# EAGLE schematic TRV_SX1231_V0.1 (EAGLE 6.3)
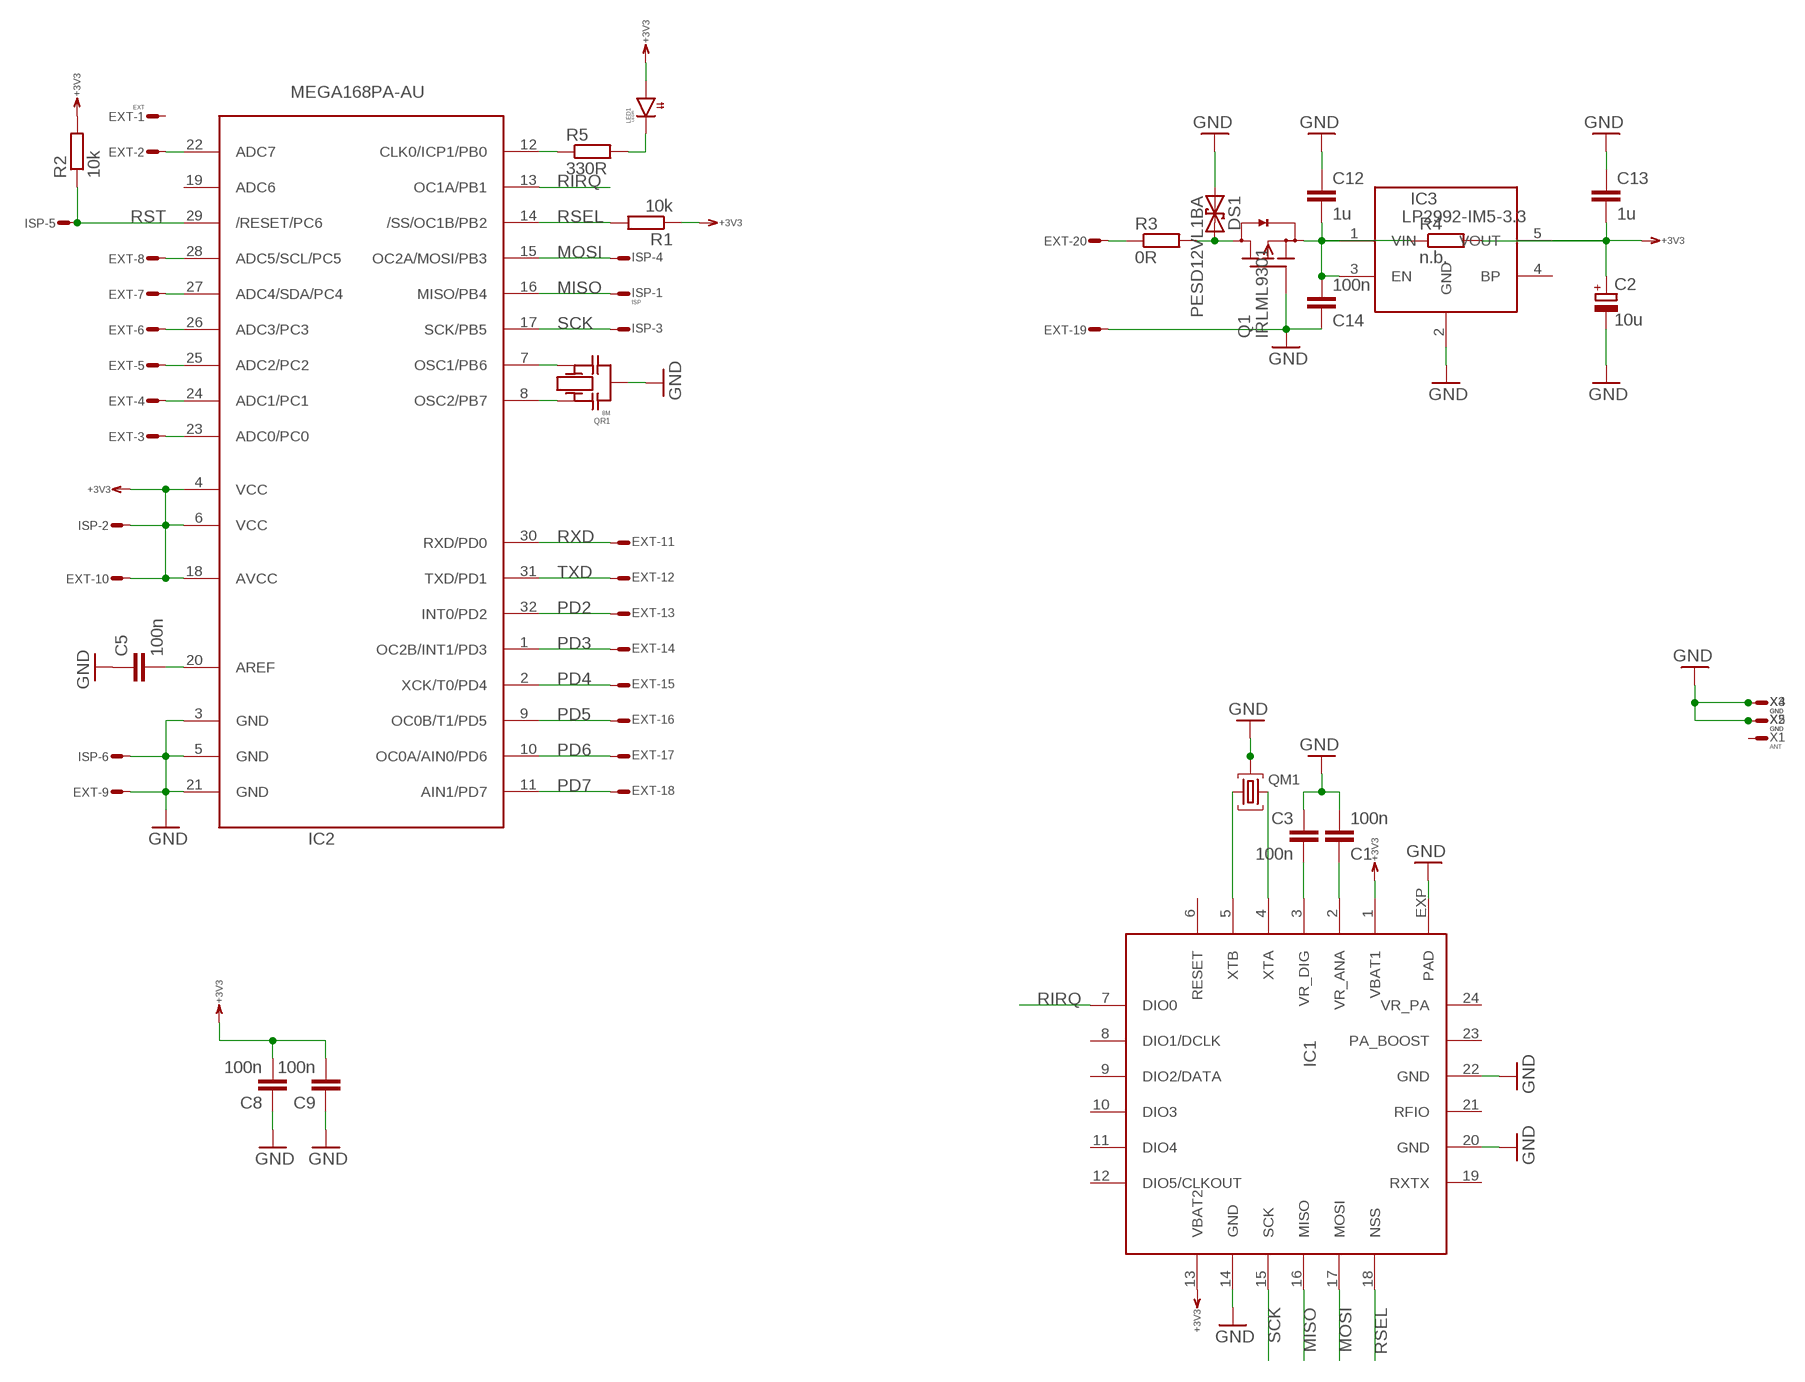
[diagram p0: schematic, sheet 1]

## Parts
C1  100n  C0603  [0603]
C2  10u  C_POLSMCB  [SMC_B]
C3  100n  C0603  [0603]
C5  100n  C0603  [0603]
C8  100n  C0603  [0603]
C9  100n  C0603  [0603]
C12  1u  C0603  [0603]
C13  1u  C0603  [0603]
C14  100n  C0603  [0603]
DS1  PESD12VL1BA  TVS-U323  [SOD323]
EXT  EXT  ML20SE  [ML20S]
IC1  SX1231  [QFN24]
IC2  MEGA168PA-AU  MEGA168PA  [TQFP32-08]
IC3  LP2992-IM5-3.3  LDO  [SOT23-5]
ISP  ISP  ML6ES  [ML6S]
LED1  LEDR  LED0603  [0603]
Q1  IRLML9301  FET-PDSOT23  [SOT23]
QM1  QM5X3.2  [ABM3C]
QR1  8M  QRCR  [CR]
R1  10k  R0603  [0603]
R2  10k  R0603  [0603]
R3  0R  R0603  [0603]
R4  n.b.  R0603  [0603]
R5  330R  R0603  [0603]
X1  ANT  WIREPADS2.54/1.27  [S2.54/1.27]
X2  GND  WIREPADS2.54/1.27  [S2.54/1.27]
X3  GND  WIREPADS2.54/1.27  [S2.54/1.27]
X4  GND  WIREPADS2.54/1.27  [S2.54/1.27]
X5  GND  WIREPADS2.54/1.27  [S2.54/1.27]

## Nets
+3V3: C2.+ C8.2 C9.2 C13.2 EXT.10 IC1.1(VBAT1) IC1.13(VBAT2) IC2.4(VCC) IC2.6(VCC) IC2.18(AVCC) IC3.5(VOUT) ISP.2 LED1.1(A) R1.1 R2.2 R4.2
GND: C1.2 C2.- C3.1 C5.1 C8.1 C9.1 C12.1 C13.1 C14.1 DS1.A EXT.9 EXT.19 IC1.14(GND) IC1.20(GND) IC1.22(GND) IC1.EXP(PAD) IC2.3(GND) IC2.5(GND) IC2.21(GND) IC3.2(GND) ISP.6 Q1.1(G) QM1.P$2(M1) QM1.P$4(M2) QR1.M X2.1(S) X3.1(S) X4.1(S) X5.1(S)
MISO: IC1.16(MISO) IC2.16(MISO/PB4) ISP.1
MOSI: IC1.17(MOSI) IC2.15(OC2A/MOSI/PB3) ISP.4
N$1: C1.1 IC1.2(VR_ANA)
N$2: C3.2 IC1.3(VR_DIG)
N$3: EXT.2 IC2.22(ADC7)
N$4: IC1.5(XTB) QM1.P$1
N$5: DS1.C Q1.3(D) R3.2
N$6: C5.2 IC2.20(AREF)
N$7: IC2.8(OSC2/PB7) QR1.1
N$8: IC2.7(OSC1/PB6) QR1.2
N$9: EXT.20 R3.1
N$10: IC2.12(CLK0/ICP1/PB0) R5.1
N$11: IC1.4(XTA) QM1.P$3
N$12: C12.2 C14.2 IC3.1(VIN) IC3.3(EN) Q1.2(S) R4.1
N$21: LED1.2(C) R5.2
PC0: EXT.3 IC2.23(ADC0/PC0)
PC1: EXT.4 IC2.24(ADC1/PC1)
PC2: EXT.5 IC2.25(ADC2/PC2)
PC3: EXT.6 IC2.26(ADC3/PC3)
PC4: EXT.7 IC2.27(ADC4/SDA/PC4)
PC5: EXT.8 IC2.28(ADC5/SCL/PC5)
PD2: EXT.13 IC2.32(INT0/PD2)
PD3: EXT.14 IC2.1(OC2B/INT1/PD3)
PD4: EXT.15 IC2.2(XCK/T0/PD4)
PD5: EXT.16 IC2.9(OC0B/T1/PD5)
PD6: EXT.17 IC2.10(OC0A/AIN0/PD6)
PD7: EXT.18 IC2.11(AIN1/PD7)
RIRQ: IC1.7(DIO0) IC2.13(OC1A/PB1)
RSEL: IC1.18(NSS) IC2.14(/SS/OC1B/PB2) R1.2
RST: IC2.29(/RESET/PC6) ISP.5 R2.1
RXD: EXT.11 IC2.30(RXD/PD0)
SCK: IC1.15(SCK) IC2.17(SCK/PB5) ISP.3
TXD: EXT.12 IC2.31(TXD/PD1)
Unconnected: EXT.1 IC1.6(RESET) IC1.8(DIO1/DCLK) IC1.9(DIO2/DATA) IC1.10(DIO3) IC1.11(DIO4) IC1.12(DIO5/CLKOUT) IC1.19(RXTX) IC1.21(RFIO) IC1.23(PA_BOOST) IC1.24(VR_PA) IC2.19(ADC6) IC3.4(BP) X1.1(S)

## Library data of the parts
C1 C3 C5 C8 C9 C12-C14 = RCL:C: Capacitor SMD
C2 = RCL:C_POL: POLARIZED CAPACITOR, European symbol
DS1 = Diode:TVS-U: DIODE
EXT = Conn:ML20?E: HARTING
IC1 = RF:SX1231
IC2 = atmel:MEGA168P: MCU, 4/8/16k, TQFP32
IC3 = DCDC:LDO
ISP = Conn:ML6E: HARTING
LED1 = Optic:LED
Q1 = Transistor:FET-PD
QM1 = QUARTZ:QM
QR1 = QUARTZ:QR
R1-R5 = RCL:R: Resistor SMD
X1-X5 = Conn:WIREPAD: Wire PAD connect wire on PCB